# Altium schematic sheet 05-UARTBridge.SchDoc
size A
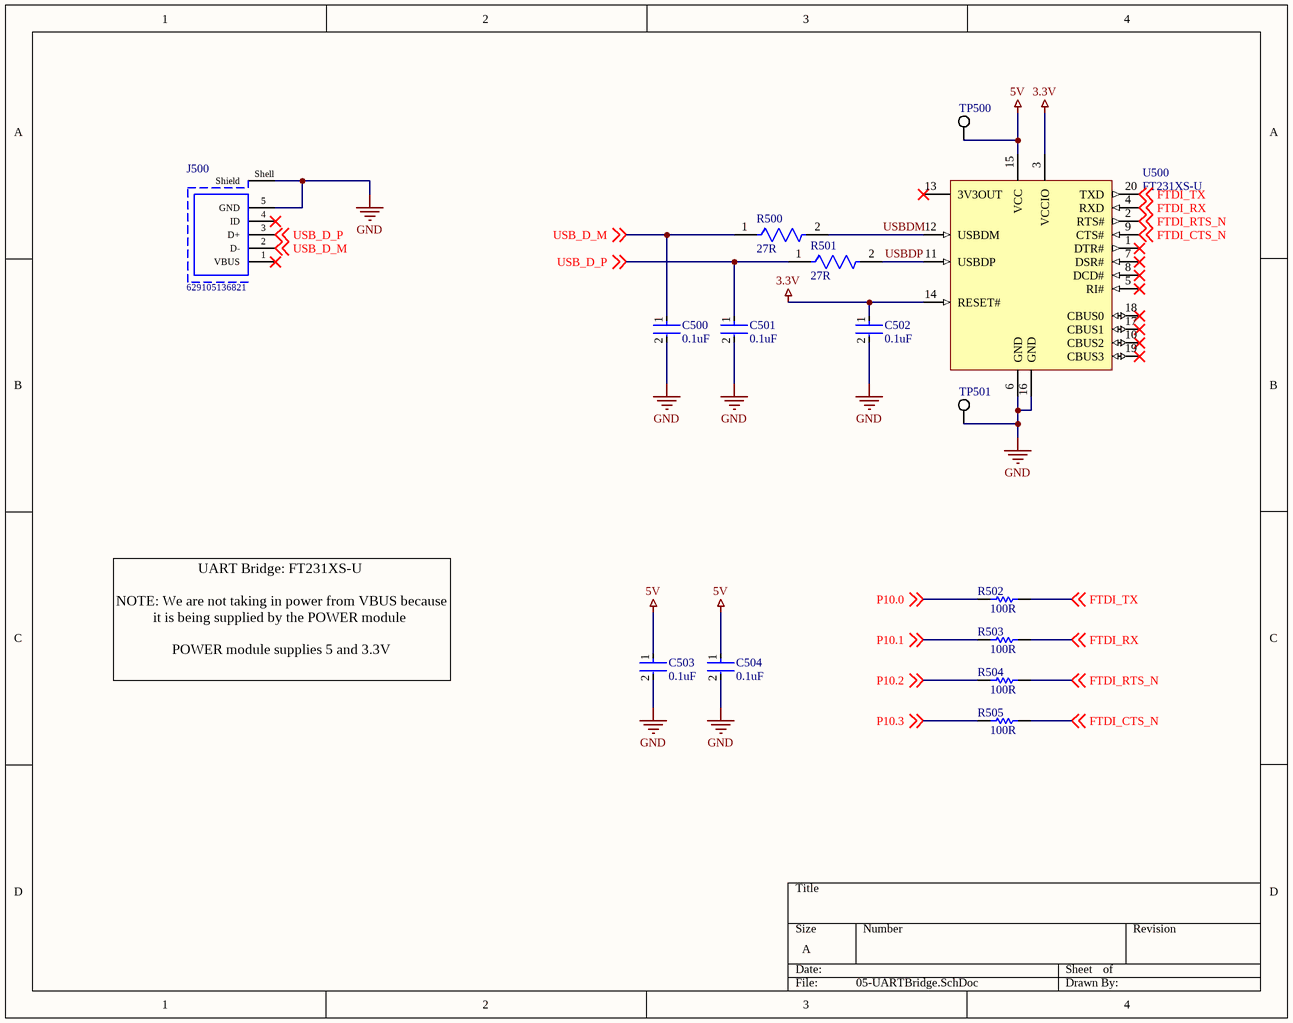
[diagram p0: 05-UARTBridge.SchDoc]

## Parts
C500  0.1uF  [FP-CL21-IPC_C]
C501  0.1uF  [FP-CL21-IPC_C]
C502  0.1uF  [FP-CL21-IPC_C]
C503  0.1uF  [FP-CL21-IPC_C]
C504  0.1uF  [FP-CL21-IPC_C]
J500  629105136821  [629105136821]
R500  27R  [FP-CRGCQ0805-IPC_C]
R501  27R  [FP-CRGCQ0805-IPC_C]
R502  100R  [RESC2013X60X40ML20T25]
R503  100R  [RESC2013X60X40ML20T25]
R504  100R  [RESC2013X60X40ML20T25]
R505  100R  [RESC2013X60X40ML20T25]
TP500  5019  [KSTN-5019_V]  (value not drawn)
TP501  5019  [KSTN-5019_V]  (value not drawn)
U500  FT231XS-U  [SSOP-20_L]

## Nets
3.3V: C502.1 U500.3(VCCIO) U500.14(RESET#)
5V: C503.1 C504.1 TP500.1 U500.15(VCC)
GND: C500.2 C501.2 C502.2 C503.2 C504.2 J500.5(GND) J500.Shell(Shield) TP501.1 U500.6(GND) U500.16(GND)
FTDI_CTS_N: R505.2 U500.9(CTS#) ; off-sheet FTDI_CTS_N
FTDI_RTS_N: R504.2 U500.2(RTS#) ; off-sheet FTDI_RTS_N
FTDI_RX: R503.2 U500.4(RXD) ; off-sheet FTDI_RX
FTDI_TX: R502.2 U500.20(TXD) ; off-sheet FTDI_TX
P10.0: R502.1 ; off-sheet P10.0
P10.1: R503.1 ; off-sheet P10.1
P10.2: R504.1 ; off-sheet P10.2
P10.3: R505.1 ; off-sheet P10.3
USB_D_M: C500.1 J500.2(D-) R500.1 ; off-sheet USB_D_M
USB_D_P: C501.1 J500.3(D+) R501.1 ; off-sheet USB_D_P
USBDM: R500.2 U500.12(USBDM)
USBDP: R501.2 U500.11(USBDP)

Not connected (* = marked no-connect by the designer): J500 1(VBUS)* 4(ID)*; U500 1(DTR#)* 5(RI#)* 7(DSR#)* 8(DCD#)* 10(CBUS2)* 13(3V3OUT)* 17(CBUS1)* 18(CBUS0)* 19(CBUS3)*

## Notes on the sheet
- UART Bridge: FT231XS-U
  NOTE: We are not taking in power from VBUS because it is being supplied by the POWER module
  POWER module supplies 5 and 3.3V

## Library data of the parts
C500-C504 = CMP-2000-05017-2: CL21 Series 0805 100nF 50V ±10% Tolerance X7R Multilayer Ceramic Chip Capacitor; Depth: 1.25mm; Height: 0.85mm; Width: 0.049inch; Tolerance: 10%; Case Code (Metric): 2012; Case Code (Imperial): 0805; Material: Ceramic; Thickness: 0.037inch; Min Operating Temperature: -55°C; Contact Plating: Tin; Length: 2mm; Mount: Surface Mount; Voltage Rating (DC): 50V; Lead Free: Lead Free; Dielectric: X7R; Radiation Hardening: No; Capacitance: 100nF; Voltage Rating: 50V; Case/Package: 0805; Packaging: Tape and Reel; Max Operating Temperature: 125°C; Voltage: 50V
J500 = CMP-1502-03253-1: Micro USB 2.0 Type B Receptacle WR-COM, Horizontal, SMT, with Pads and Pegs; Manufacturer: Wurth Elektronik; Contact Resistance: 30mOhm; Rated Current: 1A; Working Voltage: 30VAC; Datasheet URL: https://katalog.we-online.de/em/datasheet/629105136821.pdf; Mounting Technology: SMT; Publisher: WurthElektronik; Package Reference: 629105136821; Orientation: Horizontal; Packaging: TapeandReel; Part Number: 629105136821; Manufacturer URL: http://www.we-online.de; Connector Type: MicroUSB2.0TypeB; Gender: Receptacle; Operating Temperature: -40to105degC
R500 R501 = CMP-03211-007904-1: CRGCQ0805 27Ω 0.125W ±200ppm/°C 1% 150V; Manufacturer: TE Connectivity; Manufacturer Part Number: CRGCQ0805F27R; Automotive Grade: Grade 323; Tolerance: 0.01; Series: CRGCQ; Automotive: Yes; Temperature Range Low: -55°C; Voltage Rating: 150V; Height: 0.65mm; Power Rating: 0.125W; Temperature Coefficient: ±200ppm/°C; RoHS: TRUE; ComponentLink2Description: Datasheet; Package: CRGCQ0805; Temperature Range High: +155°C; Temperature: -55°C to +155°C; Ipc Land Pattern Name: RESC200125X55; Device Class L2: Resistors; Device Class L3: Chip SMD Resistors; ComponentLink2URL: https://www.te.com/commerce/DocumentDelivery/DDEController?Action=showdoc&DocId=Data+Sheet%7F1773204-3%7F1%7Fpdf%7FEnglish%7FENG_DS_1773204-3_1.pdf%7F4-2176341-332; Value: 27Ω; Mouser Description: Res General Purpose Thick Film 0805 27 Ohm 1% 1/8W ±200ppm/°C Molded Paper T/R; Octopart: https://octopart.com/crgcq0805f27r-te+connectivity-91018166; Lead Free: Yes; Composition: Thick Film; Ambient Temperature Range High: +70°C; Category: Res; Resistance: 27Ω; Device Class L1: Passive Components
R502-R505 = CMP-2001-00580-1: Manufacturer: Panasonic; Part Number: ERA6AEB101V
TP500 TP501 = CMP-1672-00008-1: Test Point, 1 Position SMD, RoHS, Tape and Reel; Manufacturer 1: Keystone Electronics; ComponentLink1Description: Manufacturer URL; Package Quantity: 1000; DatasheetVersion: 03/2014; Packaging: Tape and Reel; ComponentLink2URL: http://www.keyelco.com/product-pdf.cfm?p=1357; ComponentLink1URL: http://www.keyelco.com/; Mount: Surface Mount; Contact Plating: Silver; PackageDescription: 1-Pin Surface Mount Device, Body 3.81 x 2.03 mm; Pins: 1; RoHSCompliant: True; Mounting Technology: Surface Mount; ComponentLink2Description: Datasheet; PackageReference: 5019; Supplier 1: Digi-Key; Supplier Part Number 1: 36-5019CT-ND; Manufacturer Part Number 1: 5019; RoHS: Yes; Category: Connectors; Stock 1: 1316816; Pricing 1: 1=0.34000, 25=0.27360, 100=0.22340, 250=0.20064, 500=0.19152 (USD); Number of Pins: 1; Material: Bronze; Contact Material: Bronze; Series: 5019; Termination: SMD/SMT; Height: 0.09inch; RoHS Compliant: Yes; REACH SVHC: No SVHC; Lead Free: Lead Free; ComponentLink3URL: https://datasheet.ciiva.com/16318/m60-2p61-16318395.pdf?src-supplier=Future+Electronics; ComponentLink3Description: https://datasheet.ciiva.com/16318/m60-2p61-16318395.pdf?src-supplier=Future+Electronics; ComponentLink4URL: https://datasheet.ciiva.com/16885/70182998-16885945.pdf?src-supplier=Allied+Electronics; ComponentLink4Description: https://datasheet.ciiva.com/16885/70182998-16885945.pdf?src-supplier=Allied+Electronics; ComponentLink5URL: https://datasheet.ciiva.com/14848/m60-2p61-14848437.pdf?src-supplier=Digi-Key; ComponentLink5Description: https://datasheet.ciiva.com/14848/m60-2p61-14848437.pdf?src-supplier=Digi-Key; ComponentLink6URL: https://datasheet.ciiva.com/14848/m60-2p61-14848438.pdf?src-supplier=Digi-Key; ComponentLink6Description: https://datasheet.ciiva.com/14848/m60-2p61-14848438.pdf?src-supplier=Digi-Key; ComponentLink7URL: https://datasheet.ciiva.com/14848/m60-2p61-14848439.pdf?src-supplier=Digi-Key; ComponentLink7Description: https://datasheet.ciiva.com/14848/m60-2p61-14848439.pdf?src-supplier=Digi-Key
U500 = CMP-0248-00015-2: USB to Full-Handshake UART Interface Chip, UHCI/OHCI/EHCI Compatible, USB 2.0 Compatible, -40 to +85 degC, 20-Pin SSOP, Pb-Free, Tube; Manufacturer: FTDI; PackageDescription: 20-Pin Small Outline Package, 8.6 x 3.9 mm Body, 0.635 mm Pitch; ComponentLink2Description: Datasheet; DatasheetVersion: ver 1.2, Feb-2013; PackageReference: SSOP-20; ComponentLink3URL: www.ftdichip.com/Products/ICs/FT231X.html; ComponentLink2URL: http://www.ftdichip.com/Support/Documents/DataSheets/ICs/DS_FT231X.pdf; PartNumber: FT231XS-U; ComponentLink3Description: FT231X Product Page; ComponentLink1URL: http://www.ftdichip.com/; Code_JEDEC: MO-137-AD; ComponentLink1Description: Manufacturer URL; RevisionNote: DatasheetVersion updated to 1.2 Feb-2013; PackageVersion: Feb-13